# Altium project ASM001-design.PrjPcb (part 2 of 2)

## Sheet ASM001-design-3.SchDoc
size 558 x 431 mm
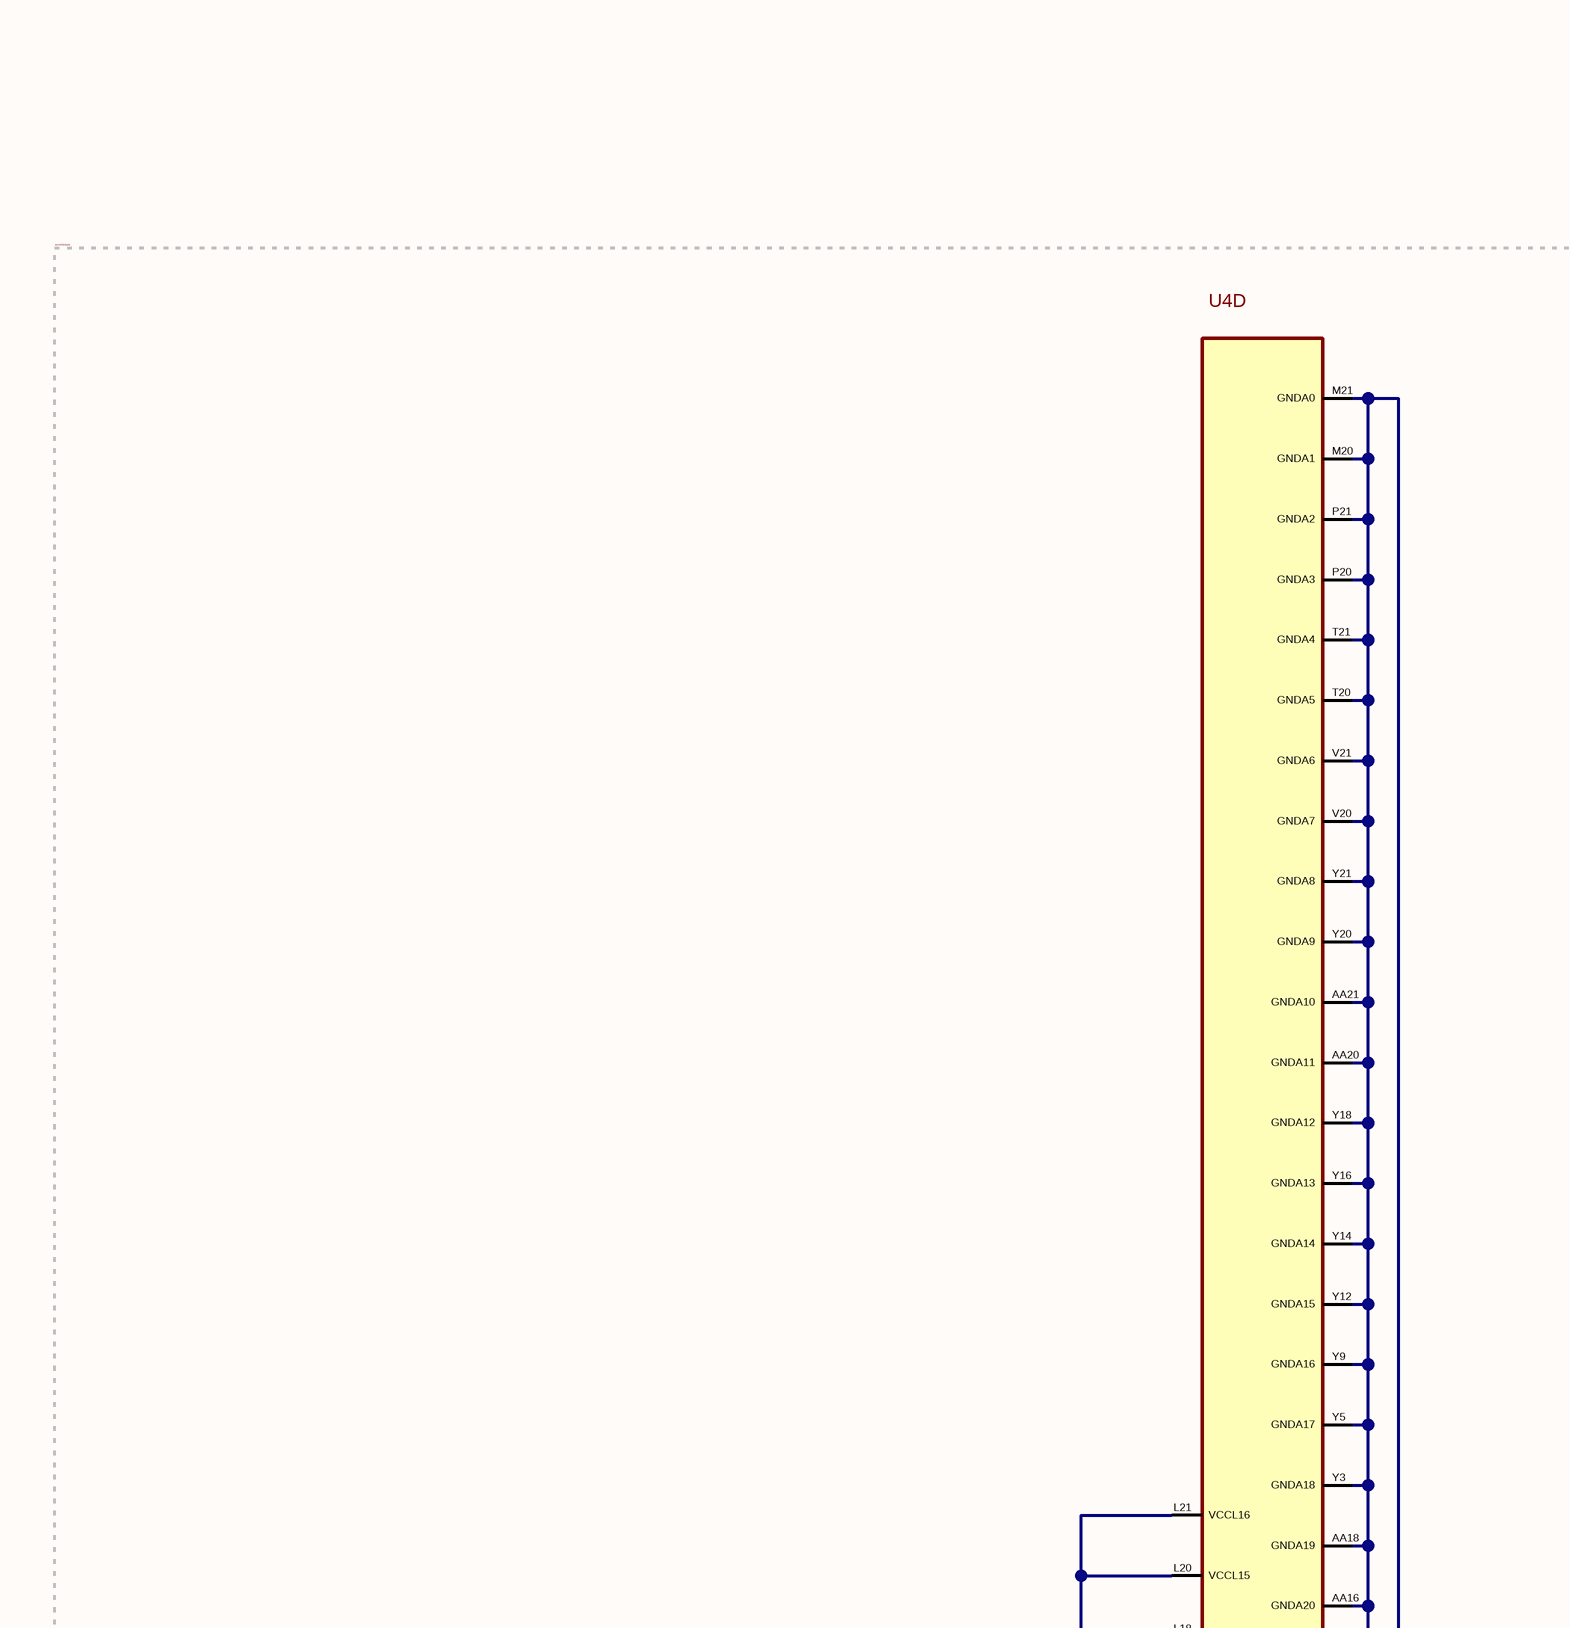
[diagram p17: ASM001-design-3.SchDoc, top column 2 of 4]
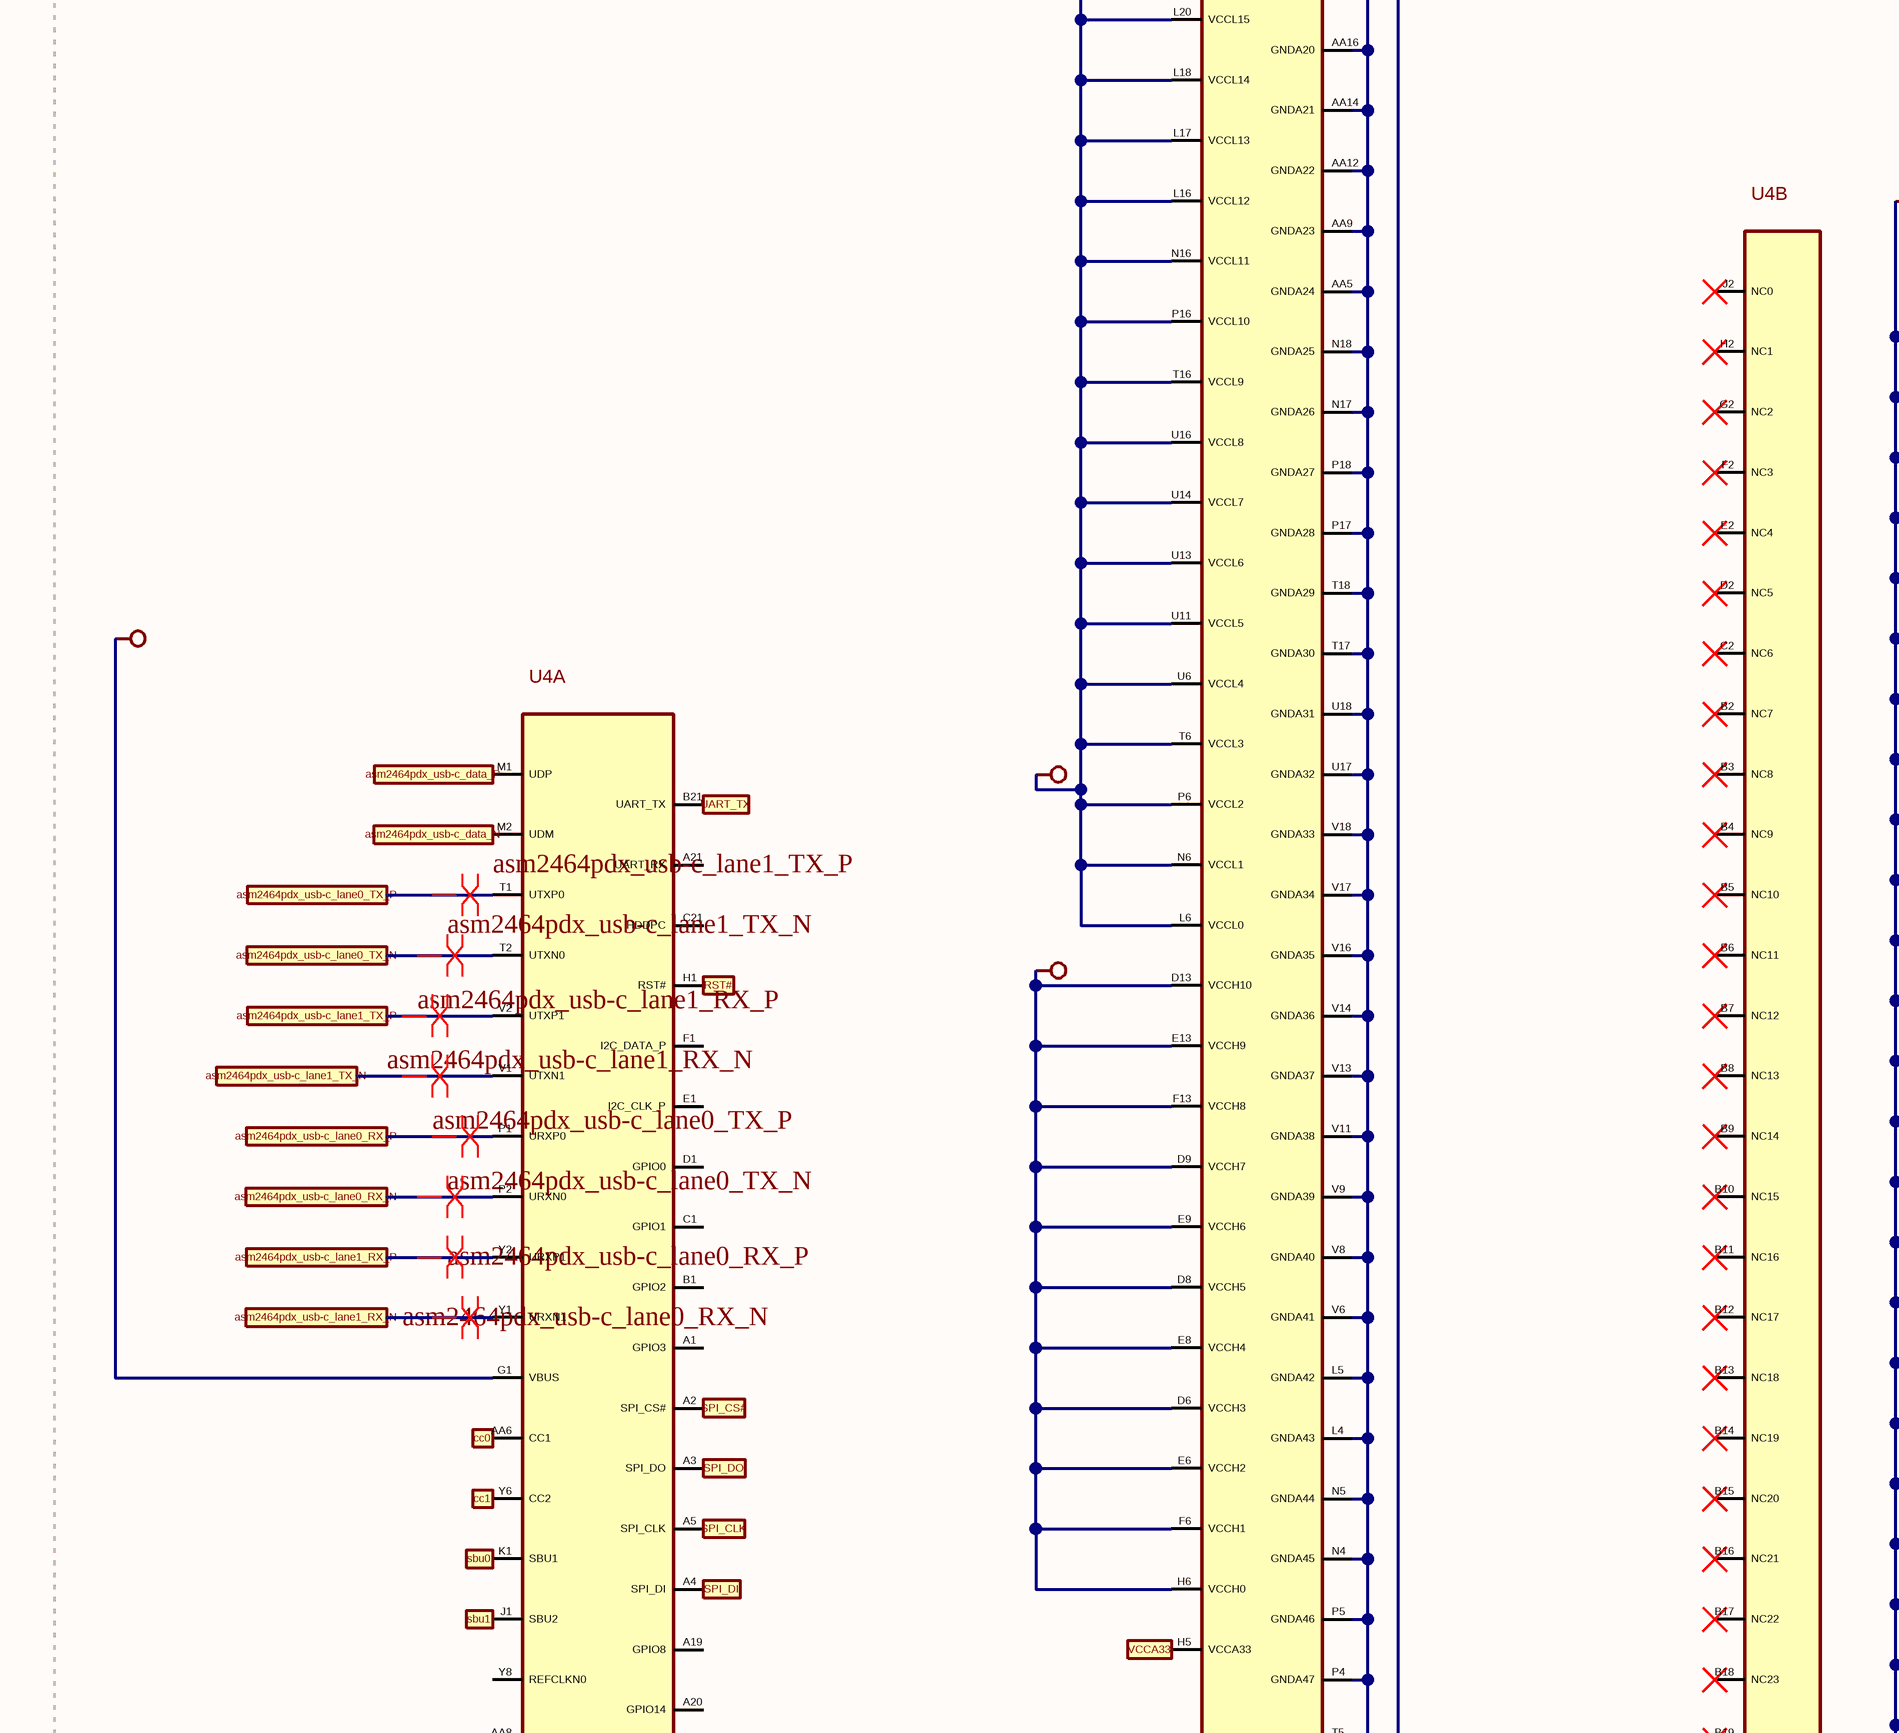
[diagram p18: ASM001-design-3.SchDoc, centre column 2 of 4]
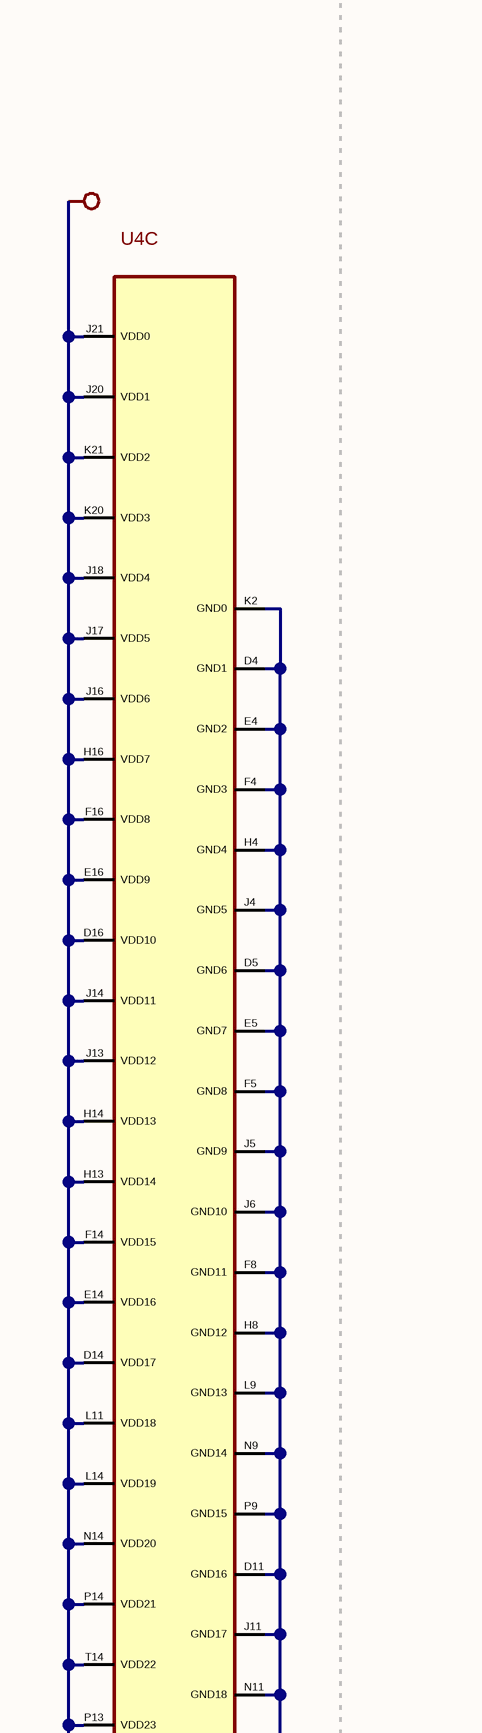
[diagram p19: ASM001-design-3.SchDoc, centre column 3 of 4]
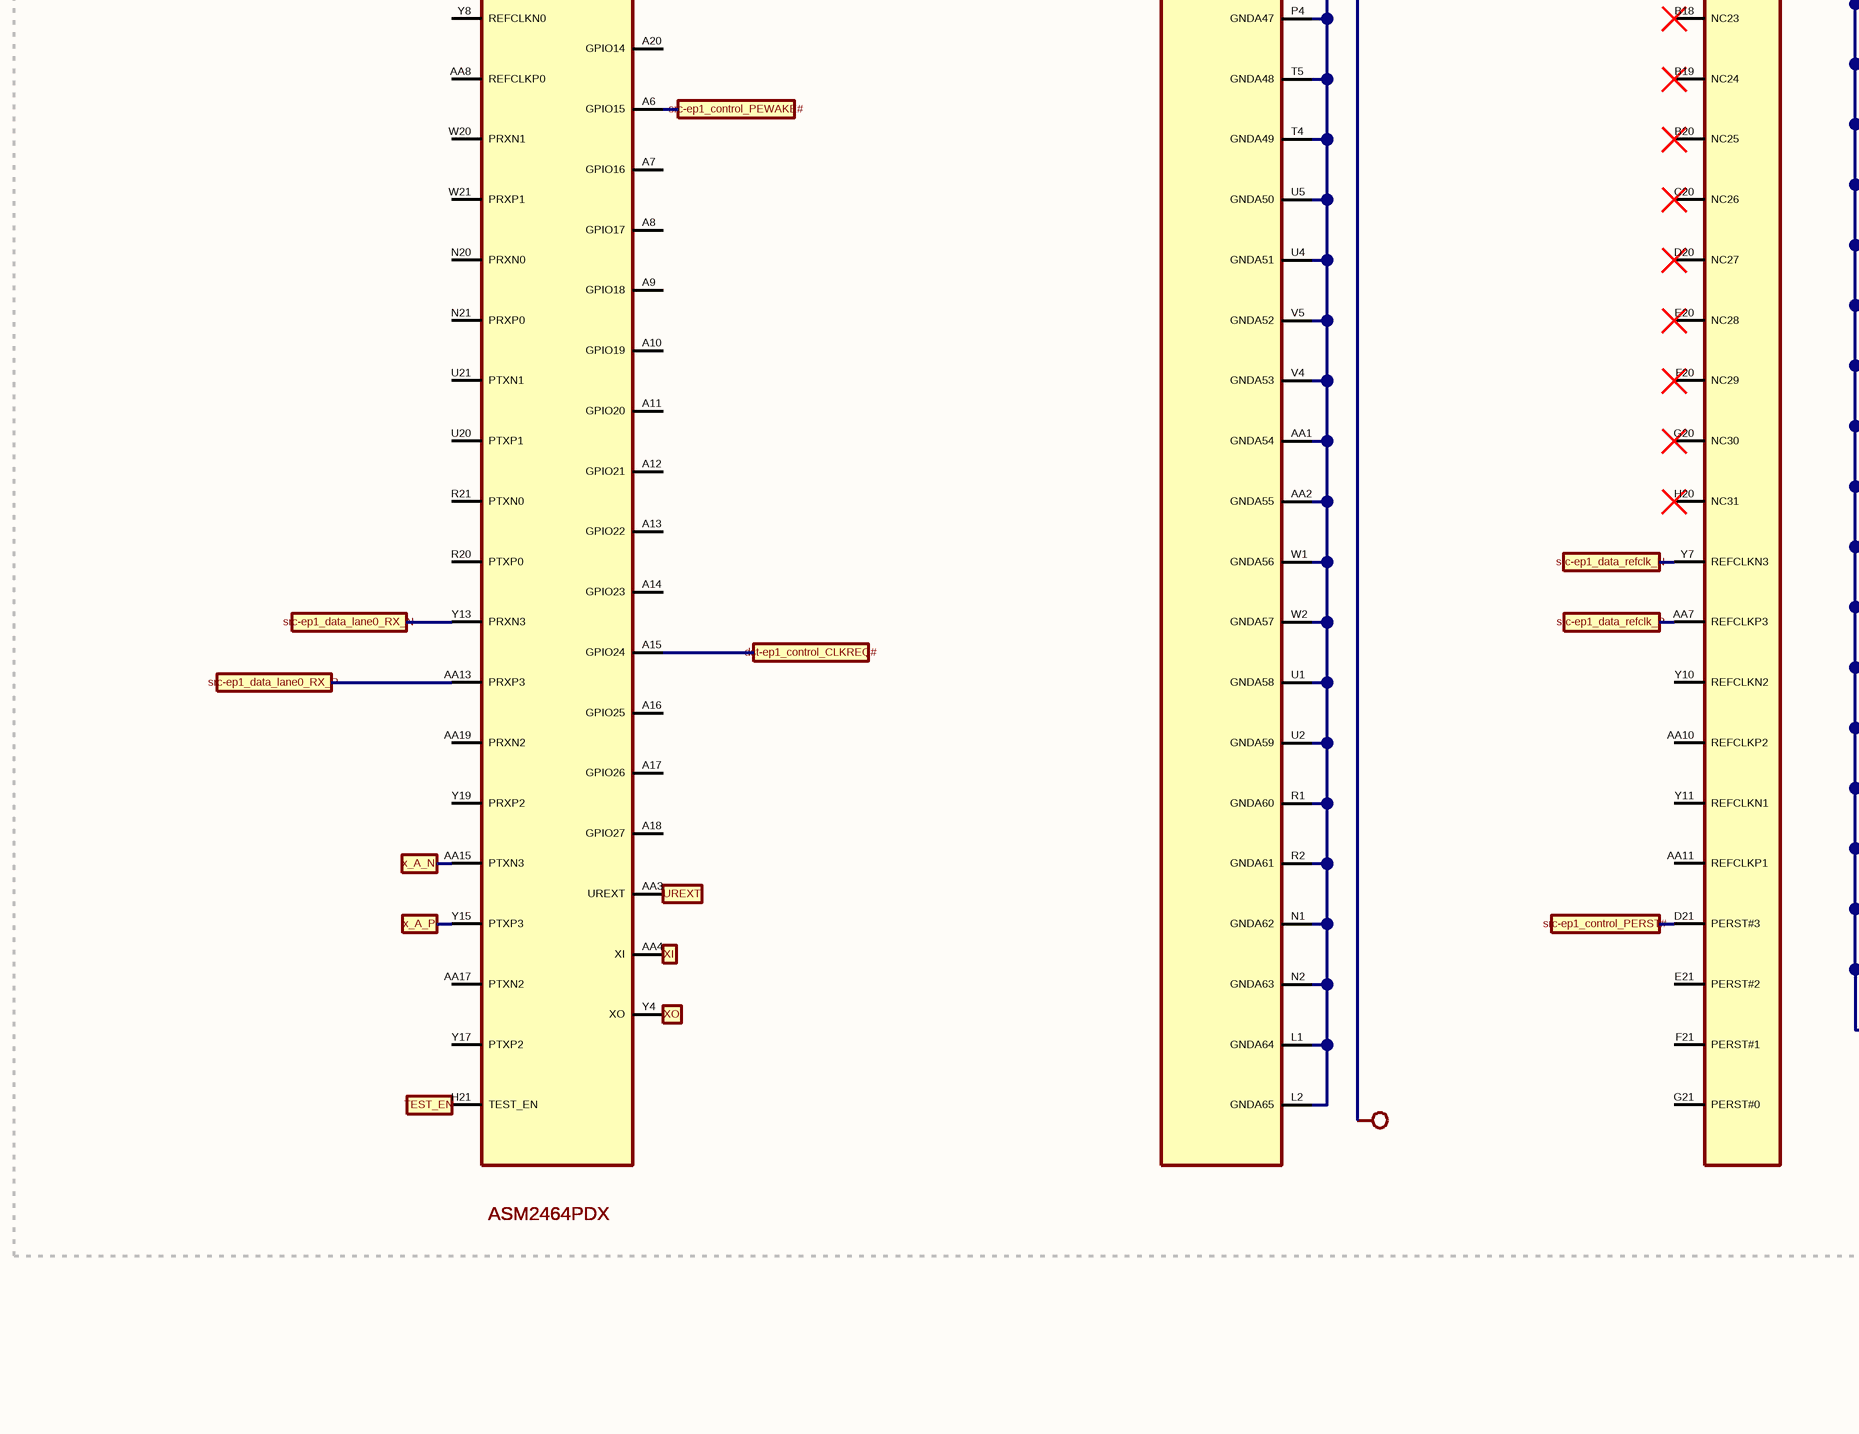
[diagram p20: ASM001-design-3.SchDoc, bottom column 2 of 4]
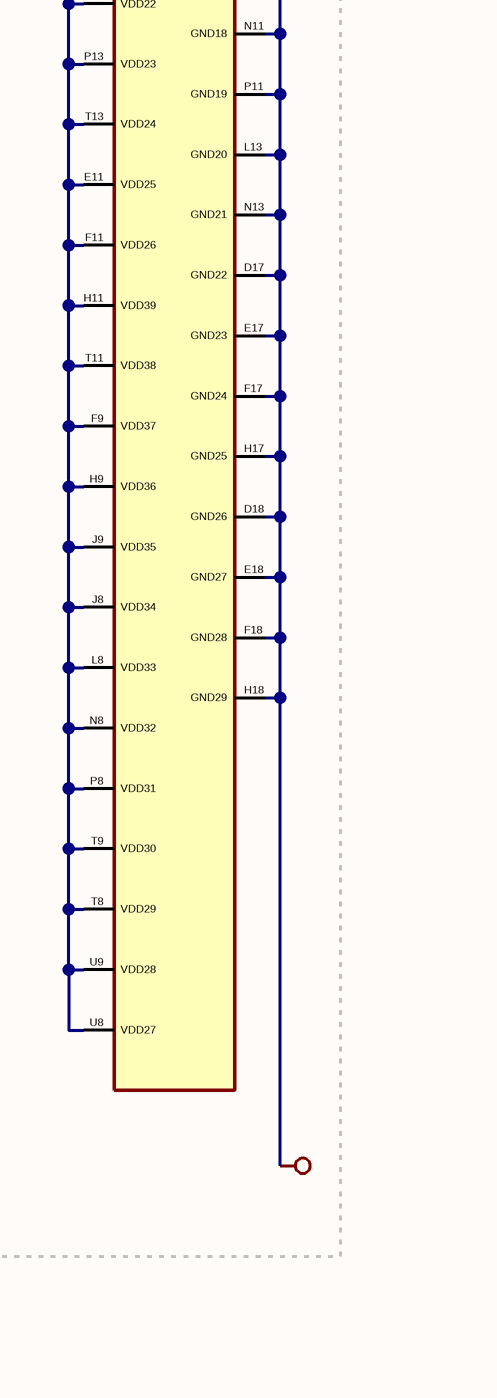
[diagram p21: ASM001-design-3.SchDoc, bottom column 3 of 4]
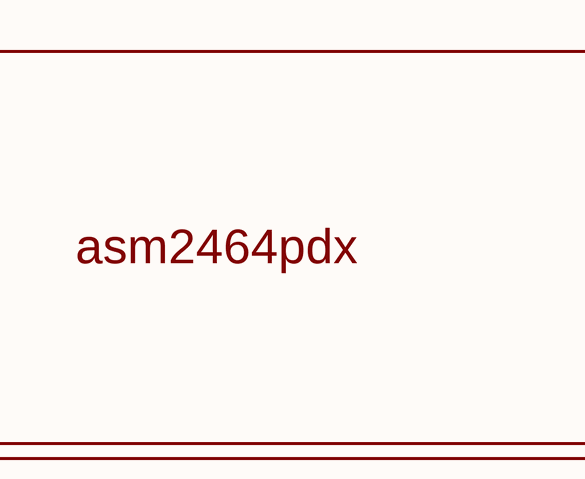
[diagram p22: ASM001-design-3.SchDoc, bottom column 4 of 4]

### Parts
U4  value ASM2464PDX  value ASM2464PDX  value ASM2464PDX  value ASM2464PDX  [BGA273N46P21X21_1000X1000X98]  (hidden comment: component$2)  (parts A,B,C,D of 4)

### Blocks framed on the sheet
asm2464pdx: U4

### Ports
asm2464pdx_usb-c_data_N, asm2464pdx_usb-c_data_P, asm2464pdx_usb-c_lane0_RX_N, asm2464pdx_usb-c_lane0_RX_P, asm2464pdx_usb-c_lane0_TX_N, asm2464pdx_usb-c_lane0_TX_P, asm2464pdx_usb-c_lane1_RX_N, asm2464pdx_usb-c_lane1_RX_P, asm2464pdx_usb-c_lane1_TX_N, asm2464pdx_usb-c_lane1_TX_P, cc0, cc1, dst-ep1_control_CLKREQ#, RST#, sbu0, sbu1, SPI_CLK, SPI_CS#, SPI_DI, SPI_DO, src-ep1_control_PERST#, src-ep1_control_PEWAKE#, src-ep1_data_lane0_RX_N, src-ep1_data_lane0_RX_P, src-ep1_data_refclk_N, src-ep1_data_refclk_P, TEST_EN, UART_TX, UREXT, VCCA33, x_A_N, x_A_P, XI, XO

### Nets
NetC1_2: U4.AA1(GNDA54) U4.AA2(GNDA55) U4.AA5(GNDA24) U4.AA9(GNDA23) U4.AA12(GNDA22) U4.AA14(GNDA21) U4.AA16(GNDA20) U4.AA18(GNDA19) U4.AA20(GNDA11) U4.AA21(GNDA10) U4.D4(GND1) U4.D5(GND6) U4.D6(VCCH3) U4.D8(VCCH5) U4.D9(VCCH7) U4.D11(GND16) U4.D13(VCCH10) U4.D14(VDD17) U4.D16(VDD10) U4.D17(GND22) U4.D18(GND26) U4.E4(GND2) U4.E5(GND7) U4.E6(VCCH2) U4.E8(VCCH4) U4.E9(VCCH6) U4.E11(VDD25) U4.E13(VCCH9) U4.E14(VDD16) U4.E16(VDD9) U4.E17(GND23) U4.E18(GND27) U4.F4(GND3) U4.F5(GND8) U4.F6(VCCH1) U4.F8(GND11) U4.F9(VDD37) U4.F11(VDD26) U4.F13(VCCH8) U4.F14(VDD15) U4.F16(VDD8) U4.F17(GND24) U4.F18(GND28) U4.G1(VBUS) U4.H4(GND4) U4.H6(VCCH0) U4.H8(GND12) U4.H9(VDD36) U4.H11(VDD39) U4.H13(VDD14) U4.H14(VDD13) U4.H16(VDD7) U4.H17(GND25) U4.H18(GND29) U4.J4(GND5) U4.J5(GND9) U4.J6(GND10) U4.J8(VDD34) U4.J9(VDD35) U4.J11(GND17) U4.J13(VDD12) U4.J14(VDD11) U4.J16(VDD6) U4.J17(VDD5) U4.J18(VDD4) U4.J20(VDD1) U4.J21(VDD0) U4.K2(GND0) U4.K20(VDD3) U4.K21(VDD2) U4.L1(GNDA64) U4.L2(GNDA65) U4.L4(GNDA43) U4.L5(GNDA42) U4.L6(VCCL0) U4.L8(VDD33) U4.L9(GND13) U4.L11(VDD18) U4.L13(GND20) U4.L14(VDD19) U4.L16(VCCL12) U4.L17(VCCL13) U4.L18(VCCL14) U4.L20(VCCL15) U4.L21(VCCL16) U4.M20(GNDA1) U4.M21(GNDA0) U4.N1(GNDA62) U4.N2(GNDA63) U4.N4(GNDA45) U4.N5(GNDA44) U4.N6(VCCL1) U4.N8(VDD32) U4.N9(GND14) U4.N11(GND18) U4.N13(GND21) U4.N14(VDD20) U4.N16(VCCL11) U4.N17(GNDA26) U4.N18(GNDA25) U4.P4(GNDA47) U4.P5(GNDA46) U4.P6(VCCL2) U4.P8(VDD31) U4.P9(GND15) U4.P11(GND19) U4.P13(VDD23) U4.P14(VDD21) U4.P16(VCCL10) U4.P17(GNDA28) U4.P18(GNDA27) U4.P20(GNDA3) U4.P21(GNDA2) U4.R1(GNDA60) U4.R2(GNDA61) U4.T4(GNDA49) U4.T5(GNDA48) U4.T6(VCCL3) U4.T8(VDD29) U4.T9(VDD30) U4.T11(VDD38) U4.T13(VDD24) U4.T14(VDD22) U4.T16(VCCL9) U4.T17(GNDA30) U4.T18(GNDA29) U4.T20(GNDA5) U4.T21(GNDA4) U4.U1(GNDA58) U4.U2(GNDA59) U4.U4(GNDA51) U4.U5(GNDA50) U4.U6(VCCL4) U4.U8(VDD27) U4.U9(VDD28) U4.U11(VCCL5) U4.U13(VCCL6) U4.U14(VCCL7) U4.U16(VCCL8) U4.U17(GNDA32) U4.U18(GNDA31) U4.V4(GNDA53) U4.V5(GNDA52) U4.V6(GNDA41) U4.V8(GNDA40) U4.V9(GNDA39) U4.V11(GNDA38) U4.V13(GNDA37) U4.V14(GNDA36) U4.V16(GNDA35) U4.V17(GNDA34) U4.V18(GNDA33) U4.V20(GNDA7) U4.V21(GNDA6) U4.W1(GNDA56) U4.W2(GNDA57) U4.Y3(GNDA18) U4.Y5(GNDA17) U4.Y9(GNDA16) U4.Y12(GNDA15) U4.Y14(GNDA14) U4.Y16(GNDA13) U4.Y18(GNDA12) U4.Y20(GNDA9) U4.Y21(GNDA8)
asm2464pdx_usb-c_data_N: U4.M2(UDM) ; port asm2464pdx_usb-c_data_N
asm2464pdx_usb-c_data_P: U4.M1(UDP) ; port asm2464pdx_usb-c_data_P
asm2464pdx_usb-c_lane0_TX_N: U4.T2(UTXN0) ; port asm2464pdx_usb-c_lane0_TX_N
asm2464pdx_usb-c_lane0_TX_N: U4.P2(URXN0) ; port asm2464pdx_usb-c_lane0_RX_N  [project net asm2464pdx_usb-c_lane0_RX_N]  [a separate net that carries the same name]
asm2464pdx_usb-c_lane0_TX_P: U4.T1(UTXP0) ; port asm2464pdx_usb-c_lane0_TX_P
asm2464pdx_usb-c_lane0_TX_P: U4.P1(URXP0) ; port asm2464pdx_usb-c_lane0_RX_P  [project net asm2464pdx_usb-c_lane0_RX_P]  [a separate net that carries the same name]
asm2464pdx_usb-c_lane1_RX_N: U4.V1(UTXN1) ; port asm2464pdx_usb-c_lane1_TX_N
asm2464pdx_usb-c_lane1_RX_N: U4.Y1(URXN1) ; port asm2464pdx_usb-c_lane1_RX_N  [a separate net that carries the same name]
asm2464pdx_usb-c_lane1_RX_P: U4.V2(UTXP1) ; port asm2464pdx_usb-c_lane1_TX_P
asm2464pdx_usb-c_lane1_RX_P: U4.Y2(URXP1) ; port asm2464pdx_usb-c_lane1_RX_P  [a separate net that carries the same name]
src-ep1_data_lane0_RX_P: U4.Y13(PRXN3) ; port src-ep1_data_lane0_RX_N
NetC2_1: U4.AA6(CC1) ; port cc0
NetC6_1: U4.Y6(CC2) ; port cc1
NetC22_1: U4.H1(RST#) ; port RST#
NetC23_1: U4.AA4(XI) ; port XI
NetC23_2: U4.Y4(XO) ; port XO
NetC35_1: U4.Y15(PTXP3) ; port x_A_P
NetC36_1: U4.AA15(PTXN3) ; port x_A_N
NetJ1_A8: U4.K1(SBU1) ; port sbu0
NetJ1_B8: U4.J1(SBU2) ; port sbu1
NetJ2_50: U4.D21(PERST#3) ; port src-ep1_control_PERST#
NetJ2_52: U4.A15(GPIO24) ; port dst-ep1_control_CLKREQ#
NetJ2_53: U4.Y7(REFCLKN3) ; port src-ep1_data_refclk_N
NetJ2_54: U4.A6(GPIO15) ; port src-ep1_control_PEWAKE#
NetJ2_55: U4.AA7(REFCLKP3) ; port src-ep1_data_refclk_P
NetR10_2: U4.H5(VCCA33) ; port VCCA33
NetR11_1: U4.B21(UART_TX) ; port UART_TX
NetR13_1: U4.AA3(UREXT) ; port UREXT
NetR14_1: U4.H21(TEST_EN) ; port TEST_EN
NetU4_A2: U4.A2(SPI_CS#) ; port SPI_CS#
NetU4_A3: U4.A3(SPI_DO) ; port SPI_DO
NetU4_A4: U4.A4(SPI_DI) ; port SPI_DI
NetU4_A5: U4.A5(SPI_CLK) ; port SPI_CLK
NetU4_AA13: U4.AA13(PRXP3) ; port src-ep1_data_lane0_RX_P

Not connected (* = marked no-connect by the designer): U4 A1(GPIO3) A7(GPIO16) A8(GPIO17) A9(GPIO18) A10(GPIO19) A11(GPIO20) A12(GPIO21) A13(GPIO22) A14(GPIO23) A16(GPIO25) A17(GPIO26) A18(GPIO27) A19(GPIO8) A20(GPIO14) A21(UART_RX) AA8(REFCLKP0) AA10(REFCLKP2) AA11(REFCLKP1) AA17(PTXN2) AA19(PRXN2) B1(GPIO2) B2(NC7)* B3(NC8)* B4(NC9)* B5(NC10)* B6(NC11)* B7(NC12)* B8(NC13)* B9(NC14)* B10(NC15)* B11(NC16)* B12(NC17)* B13(NC18)* B14(NC19)* B15(NC20)* B16(NC21)* B17(NC22)* B18(NC23)* B19(NC24)* B20(NC25)* C1(GPIO1) C2(NC6)* C20(NC26)* C21(HDDPC) D1(GPIO0) D2(NC5)* D20(NC27)* E1(I2C_CLK_P) E2(NC4)* E20(NC28)* E21(PERST#2) F1(I2C_DATA_P) F2(NC3)* F20(NC29)* F21(PERST#1) G2(NC2)* G20(NC30)* G21(PERST#0) H2(NC1)* H20(NC31)* J2(NC0)* N20(PRXN0) N21(PRXP0) R20(PTXP0) R21(PTXN0) U20(PTXP1) U21(PTXN1) W20(PRXN1) W21(PRXP1) Y8(REFCLKN0) Y10(REFCLKN2) Y11(REFCLKN1) Y17(PTXP2) Y19(PRXP2)

### Layout directives
differential pair: asm2464pdx_usb-c_lane0_RX_N, asm2464pdx_usb-c_lane0_RX_P, asm2464pdx_usb-c_lane0_TX_N, asm2464pdx_usb-c_lane0_TX_P, asm2464pdx_usb-c_lane1_RX_N, asm2464pdx_usb-c_lane1_RX_P

### Notes on the sheet
- asm2464pdx
- Labels drawn without touching a wire or pin: asm2464pdx_usb-c_lane0_RX_N, asm2464pdx_usb-c_lane0_RX_P, asm2464pdx_usb-c_lane1_TX_N, asm2464pdx_usb-c_lane1_TX_P

### Library data of the parts
U4 = component$2: REFERENCE: false; FOOTPRINT: ASM001-design:BGA273N46P21X21_1000X1000X98; MPN: ASM2464PDX

## Sheet ASM001-design-4.SchDoc
size 558 x 431 mm
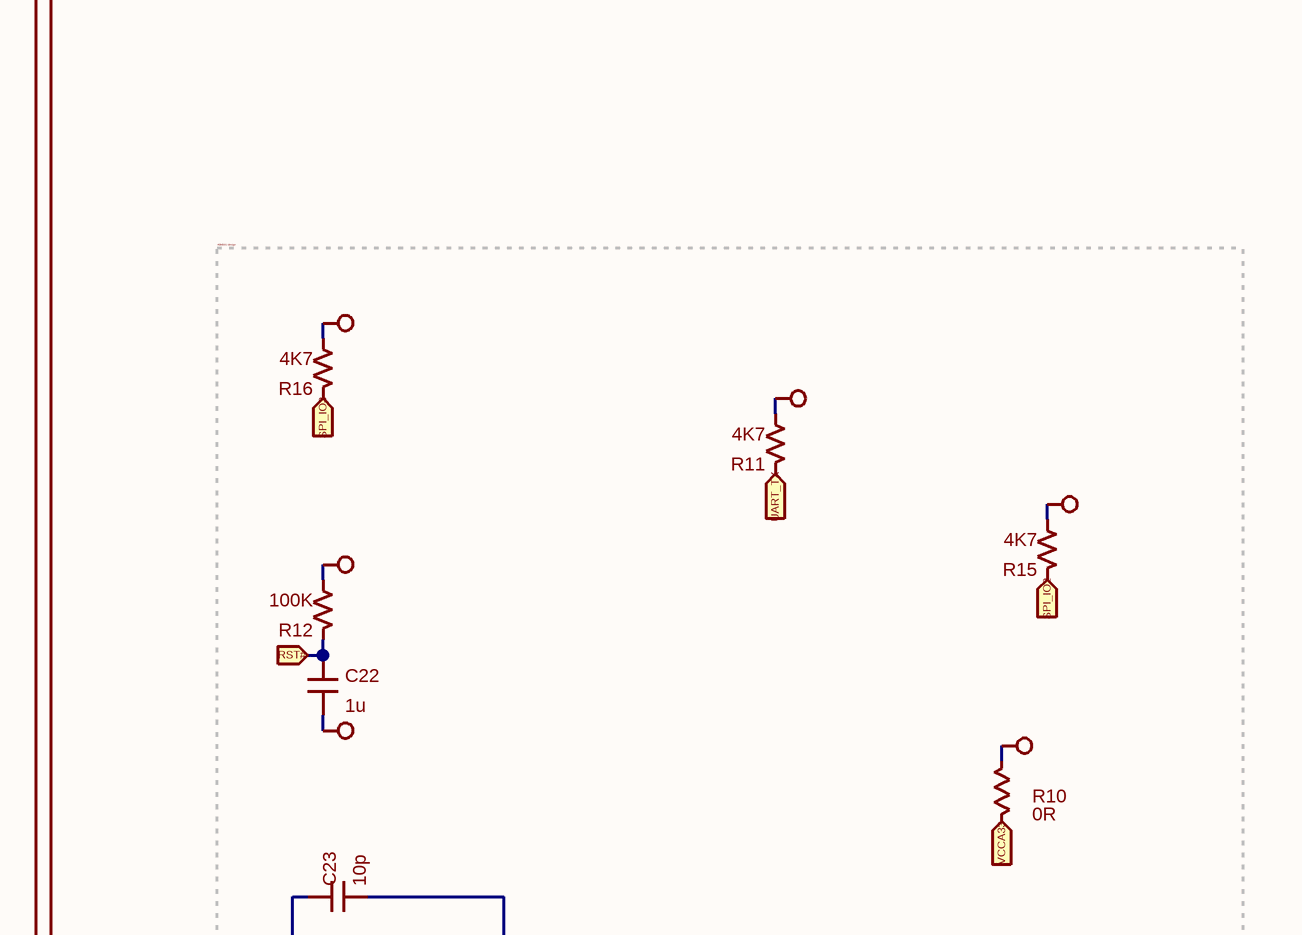
[diagram p23: ASM001-design-4.SchDoc, centre column 1 of 4]
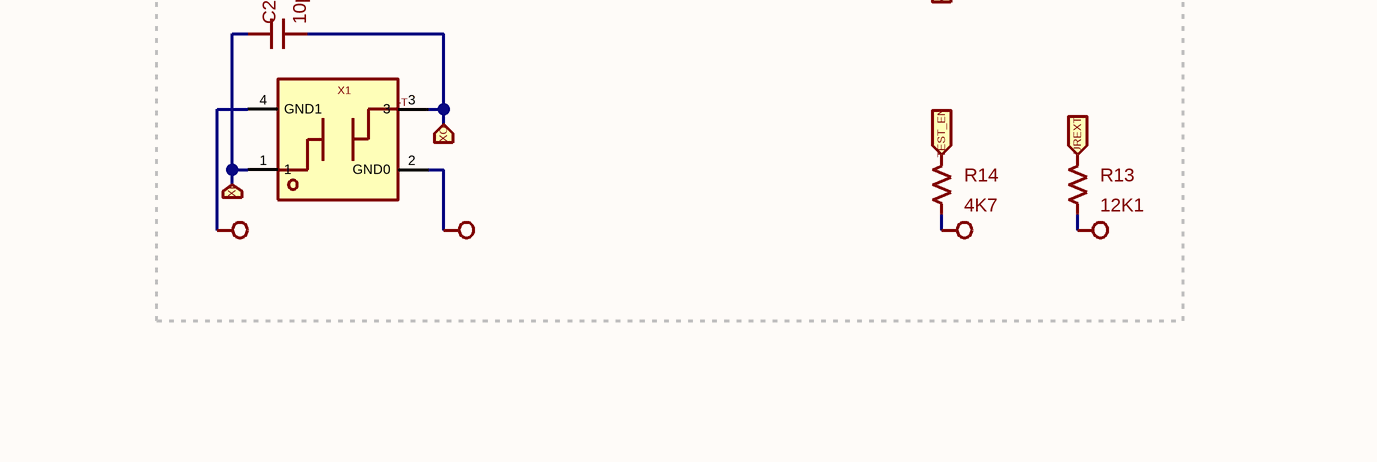
[diagram p24: ASM001-design-4.SchDoc, bottom column 1 of 4]
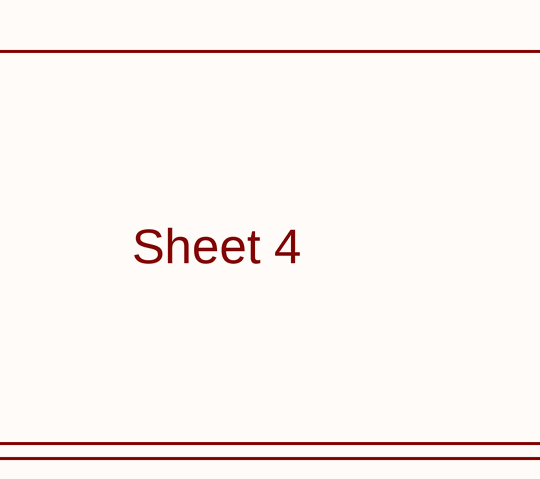
[diagram p25: ASM001-design-4.SchDoc, bottom column 4 of 4]

### Parts
C22  value 1u  [Pkg0402$2]  (hidden comment: C1518208)
C23  value 10p  [LP]  (hidden comment: my_capacitor)
R10  value 0R  [SMT_0201]  (hidden comment: C106228)
R11  value 4K7  [Pkg0402$10]  (hidden comment: my_resistor$7)
R12  value 100K  [Pkg0201$2]  (hidden comment: my_resistor$8)
R13  value 12K1  [Pkg0402$5]  (hidden comment: C168199)
R14  value 4K7  [Pkg0402$10]  (hidden comment: my_resistor$7)
R15  value 4K7  [Pkg0402$10]  (hidden comment: my_resistor$7)
R16  value 4K7  [Pkg0402$10]  (hidden comment: my_resistor$7)
X1  value ABMM2-25.000MHZ-D1-T  [LP$2]  (hidden comment: C1985419)

### Blocks framed on the sheet
ASM001-design: C22 C23 R10-R16 X1

### Ports
RST#, SPI_IO2, SPI_IO3, TEST_EN, UART_TX, UREXT, VCCA33, XI, XO

### Nets
NetC1_2: C22.2 R10.1 R11.2 R12.2 R13.2 R14.2 R15.2 R16.2 X1.2(GND0) X1.4(GND1)
NetC22_1: C22.1 R12.1 ; port RST#
NetC23_1: C23.1 X1.1 ; port XI
NetC23_2: C23.2 X1.3 ; port XO
NetR10_2: R10.2 ; port VCCA33
NetR11_1: R11.1 ; port UART_TX
NetR13_1: R13.1 ; port UREXT
NetR14_1: R14.1 ; port TEST_EN
NetR15_1: R15.1 ; port SPI_IO2
NetR16_1: R16.1 ; port SPI_IO3

### Notes on the sheet
- Sheet 4

### Library data of the parts
C22 = C1518208: manufacturer_aliases: ["Murata Electronics"]; manufacturer: Murata Electronics; mpn_aliases: ["GRM155R61H105KE05D"]; mpn: GRM155R61H105KE05D; REFERENCE: false; capacitor: true; metadata.applications: General Purpose; metadata.packaging: Tape & Reel (TR); reference_prefix: C; area: 0.5; tolerance: Toleranced(9.0e-007 <= 1.0e-006 <= 1.1e-006); rated-voltage: 50.0; query-properties: ["case" => ["0201" "0402"] "rated-voltage" => 50.0 "capacitance" => 1.0e-006 "tolerance" => 0.1 "type" => "ceramic" "temperature-coefficient.code" => ["X7R" "X5R"] "category" => "capacitor" "mounting" => "smd" "min-stock" => 1 "_sellers" => ["JLCPCB"]]; trust: low; minimum_quantity: 5; cofactr_id: CCK5EGLHOV3I; rated-temperature: Toleranced(-55.0 <= 15.0 <= 85.0); capacitance: 1.0e-006; temperature-coefficent: X5R; y: 1.0; type: ceramic; metadata.description: 50V 1uF X5R ±10% 0402  Multilayer Ceramic Capacitors MLCC - SMD/SMT ROHS; Maximum Voltage: 50.0V; FOOTPRINT: ASM001-design:Pkg0402$2; vendor_part_numbers.lcsc: C1518208; price: 0.025652174; stock: 222336; mounting: smd; case: 0402; vendor_part_numbers.digi-key: 490-GRM155R61H105KE05DTR-ND; x: 0.5; category: capacitor; Datasheet: https://wmsc.lcsc.com/wmsc/upload/file/pdf/v2/lcsc/2201180430_Murata-Electronics-GRM155R61H105KE05D_C1518208.pdf
C23 = my_capacitor: mpn_aliases: ["04025A100FAT2A"]; manufacturer_aliases: ["AVX Corporation"]; MPN: 04025A100FAT2A; Manufacturer: KYOCERA AVX; REFERENCE: false; cofactr_id: CCOVHWU6D1V4; metadata.applications: General Purpose; metadata.packaging: Tape & Reel (TR); reference_prefix: C; rated-temperature: Toleranced(-55.0 <= 35.0 <= 125.0); area: 0.5; tolerance: Toleranced(9.9e-012 <= 1.0e-011 <= 1.01e-011); capacitance: 1.0e-011; temperature-coefficent: C0G; rated-voltage: 50.0; trust: low; y: 1.0; z: 0.56; type: ceramic; metadata.description: CAP CER 10PF 50V NP0 0402; Maximum Voltage: 50.0V; FOOTPRINT: ASM001-design:LP; mounting: smd; case: 0402; x: 0.5; category: capacitor; Datasheet: https://datasheets.avx.com/C0GNP0-Dielectric.pdf
R10 = C106228: MPN: RC0201JR-070RL; Manufacturer: YAGEO; REFERENCE: false; Maximum Power: 0.05W; FOOTPRINT: ASM001-design:SMT_0201; Resistance: 0R; Datasheet: https://www.lcsc.com/datasheet/lcsc_datasheet_2304140030_YAGEO-RC0201JR-070RL_C106228.pdf
R11 R14-R16 = my_resistor$7: mpn_aliases: ["SCR0402F4K7"]; mpn: SCR0402F4K7; manufacturer_aliases: ["VO"]; manufacturer: VO; REFERENCE: false; cofactr_id: RC99FREJ1KLN; reference_prefix: R; resistor: true; area: 0.5; tolerance: Toleranced(4653.0 <= 4700.0 <= 4747.0); query-properties: ["case" => ["0201" "0402"] "resistance" => 4700.0 "tolerance" => 0.01 "category" => "resistor" "mounting" => "smd" "min-stock" => 1 "_sellers" => ["JLCPCB"]]; trust: low; y: 1.0; resistance: 4700.0; minimum_quantity: 20; metadata.description: ±1% 4.7kΩ 0402  Chip Resistor - Surface Mount ROHS; FOOTPRINT: ASM001-design:Pkg0402$10; vendor_part_numbers.lcsc: C3015810; mounting: smd; price: 0.000405797; case: 0402; stock: 1006; x: 0.5; category: resistor; Datasheet: https://wmsc.lcsc.com/wmsc/upload/file/pdf/v2/lcsc/2206021130_VO-SCR0402F4K7_C3015810.pdf
R12 = my_resistor$8: mpn_aliases: ["SC0201F1003G1BNRH"]; mpn: SC0201F1003G1BNRH; manufacturer_aliases: ["Sunway"]; manufacturer: Sunway; REFERENCE: false; reference_prefix: R; resistor: true; area: 0.18; tolerance: Toleranced(99000.0 <= 100000.0 <= 101000.0); query-properties: ["case" => ["0201" "0402"] "resistance" => 100000.0 "tolerance" => 0.01 "category" => "resistor" "mounting" => "smd" "min-stock" => 1 "_sellers" => ["JLCPCB"]]; x: 0.3; trust: low; y: 0.6; resistance: 100000.0; minimum_quantity: 20; rated-power: 0.05; metadata.description: 50mW ±1% ±200ppm/℃ 100kΩ 0201  Chip Resistor - Surface Mount ROHS; Maximum Power: 0.05W; FOOTPRINT: ASM001-design:Pkg0201$2; vendor_part_numbers.lcsc: C3152012; mounting: smd; price: 0.000463768; case: 0201; stock: 11487; category: resistor; Datasheet: https://datasheet.lcsc.com/lcsc/2207281830_Sunway-SC0201F1003G1BNRH_C3152012.pdf
R13 = C168199: manufacturer_aliases: ["Walsin Technology Corporation"]; manufacturer: Walsin Technology Corporation; mpn_aliases: ["WR04X1212FTL"]; mpn: WR04X1212FTL; REFERENCE: false; metadata.number-of-terminations: 2.0; TCR: [-0.0001 0.0001]; metadata.packaging: Tape & Reel (TR); reference_prefix: R; resistor: true; area: 0.5; tolerance: Toleranced(11979.0 <= 12100.0 <= 12221.0); query-properties: ["tolerance" => 0.01 "case" => ["0201" "0402"] "resistance" => 12100.0 "category" => "resistor" "mounting" => "smd" "min-stock" => 1 "_sellers" => ["JLCPCB"]]; trust: low; minimum_quantity: 20; cofactr_id: XX5RG112LRR9; rated-temperature: Toleranced(-55.0 <= 50.0 <= 155.0); y: 1.0; resistance: 12100.0; rated-power: 0.063; metadata.description: 62.5mW Thick Film Resistors ±100ppm/℃ ±1% 12.1kΩ 0402  Chip Resistor - Surface Mount ROHS; Maximum Power: 0.063W; FOOTPRINT: ASM001-design:Pkg0402$5; vendor_part_numbers.lcsc: C168199; price: 0.000362319; stock: 3370; mounting: smd; composition: thick-film; case: 0402; metadata.supplier-device-package: 402; vendor_part_numbers.digi-key: 1292-WR04X1212FTLTR-ND; x: 0.5; type: chip; category: resistor; Datasheet: https://www.lcsc.com/datasheet/lcsc_datasheet_2304140030_Walsin-Tech-Corp-WR04X1212FTL_C168199.pdf
X1 = C1985419: manufacturer_aliases: ["Abracon LLC"]; mpn_aliases: ["ABMM2-25.000MHZ-D1-T"]; Manufacturer: ABRACON; REFERENCE: false; cofactr_id: OSDU487NIJMB; reference_prefix: X; x: 6.302; trust: low; y: 3.901; area: 24.584; FOOTPRINT: ASM001-design:LP$2; case: SMD6036-4P; mounting: smd; category: resonator; MPN: ABMM2-25.000MHZ-D1-T; Datasheet: https://wmsc.lcsc.com/wmsc/upload/file/pdf/v2/lcsc/2304140030_Abracon-LLC-ABMM2-25-000MHZ-D1-T_C1985419.pdf

## Sheet ASM001-design-5.SchDoc
size 558 x 431 mm
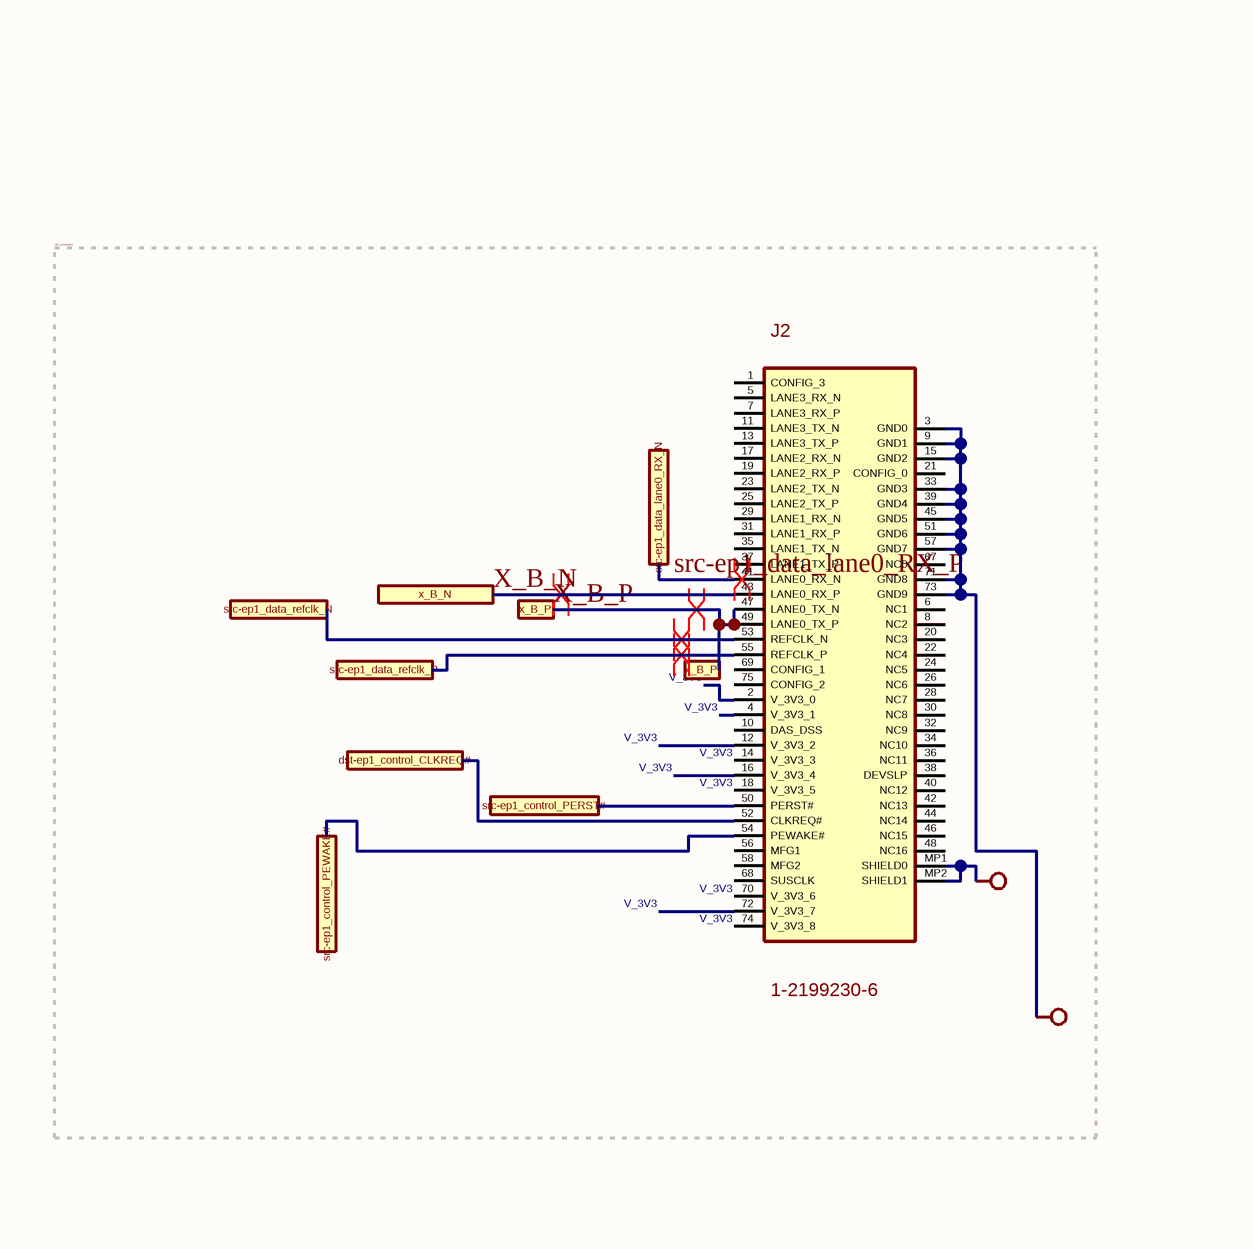
[diagram p26: ASM001-design-5.SchDoc, bottom column 2 of 4]
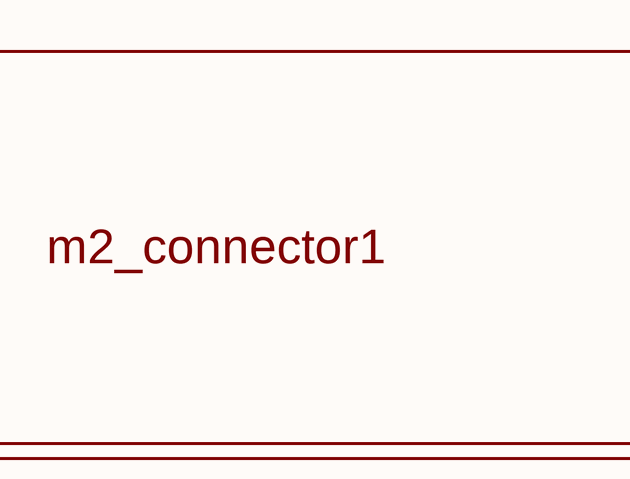
[diagram p27: ASM001-design-5.SchDoc, bottom column 4 of 4]

### Parts
J2  value 1-2199230-6  [LP_1_2199230_6]  (hidden comment: component)

### Blocks framed on the sheet
m2_connector1: J2

### Ports
dst-ep1_control_CLKREQ#, src-ep1_control_PERST#, src-ep1_control_PEWAKE#, src-ep1_data_lane0_RX_N, src-ep1_data_refclk_N, src-ep1_data_refclk_P, x_B_N, x_B_P

### Nets
NetC1_2: J2.3(GND0) J2.9(GND1) J2.15(GND2) J2.33(GND3) J2.39(GND4) J2.45(GND5) J2.51(GND6) J2.57(GND7) J2.71(GND8) J2.73(GND9) J2.MP1(SHIELD0) J2.MP2(SHIELD1)
src-ep1_data_lane0_RX_P: J2.41(LANE0_RX_N) ; port src-ep1_data_lane0_RX_N
V_3V3: J2.2(V_3V3_0) J2.4(V_3V3_1) J2.12(V_3V3_2) J2.14(V_3V3_3) J2.16(V_3V3_4) J2.18(V_3V3_5) J2.70(V_3V3_6) J2.72(V_3V3_7) J2.74(V_3V3_8)
X_B_N: J2.43(LANE0_RX_P) ; port x_B_N
X_B_P: J2.47(LANE0_TX_N) J2.49(LANE0_TX_P) ; port x_B_P
NetJ2_50: J2.50(PERST#) ; port src-ep1_control_PERST#
NetJ2_52: J2.52(CLKREQ#) ; port dst-ep1_control_CLKREQ#
NetJ2_53: J2.53(REFCLK_N) ; port src-ep1_data_refclk_N
NetJ2_54: J2.54(PEWAKE#) ; port src-ep1_control_PEWAKE#
NetJ2_55: J2.55(REFCLK_P) ; port src-ep1_data_refclk_P

Not connected (* = marked no-connect by the designer): J2 1(CONFIG_3) 5(LANE3_RX_N) 6(NC1) 7(LANE3_RX_P) 8(NC2) 10(DAS_DSS) 11(LANE3_TX_N) 13(LANE3_TX_P) 17(LANE2_RX_N) 19(LANE2_RX_P) 20(NC3) 21(CONFIG_0) 22(NC4) 23(LANE2_TX_N) 24(NC5) 25(LANE2_TX_P) 26(NC6) 28(NC7) 29(LANE1_RX_N) 30(NC8) 31(LANE1_RX_P) 32(NC9) 34(NC10) 35(LANE1_TX_N) 36(NC11) 37(LANE1_TX_P) 38(DEVSLP) 40(NC12) 42(NC13) 44(NC14) 46(NC15) 48(NC16) 56(MFG1) 58(MFG2) 67(NC0) 68(SUSCLK) 69(CONFIG_1) 75(CONFIG_2)

### Layout directives
differential pair: NetJ2_53, NetJ2_55, src-ep1_data_lane0_RX_P, X_B_N, X_B_P

### Notes on the sheet
- m2_connector1

### Library data of the parts
J2 = component: manufacturer: TE Connectivity; REFERENCE: false; FOOTPRINT: ASM001-design:LP_1_2199230_6; Digi-Key_Part_Number: A118046TR-ND; MPN: 1-2199230-6

## Nets that join several sheets
NetC1_2: ASM001-design-1 (10 pins), ASM001-design-2 (56 pins), ASM001-design-3 (165 pins), ASM001-design-4 (10 pins), ASM001-design-5 (12 pins)
asm2464pdx_usb-c_data_N: ASM001-design-1 (J1.A7 J1.B7 U7.1 U7.2), ASM001-design-2 (U8.5 U8.6), ASM001-design-3 (U4.M2)
asm2464pdx_usb-c_data_P: ASM001-design-1 (J1.A6 J1.B6 U6.1 U6.2), ASM001-design-2 (U8.4 U8.7), ASM001-design-3 (U4.M1)
asm2464pdx_usb-c_lane0_RX_N: ASM001-design-1 (J1.B10), ASM001-design-2 (R7.1), ASM001-design-3 (U4.P2)
asm2464pdx_usb-c_lane0_RX_P: ASM001-design-1 (J1.B11), ASM001-design-2 (R17.1), ASM001-design-3 (U4.P1)
asm2464pdx_usb-c_lane0_TX_N: ASM001-design-1 (J1.A3), ASM001-design-2 (R29.1), ASM001-design-3 (U4.T2)
asm2464pdx_usb-c_lane0_TX_P: ASM001-design-1 (J1.A2), ASM001-design-2 (R27.1), ASM001-design-3 (U4.T1)
asm2464pdx_usb-c_lane1_RX_N: ASM001-design-1 (J1.B3), ASM001-design-2 (R33.1), ASM001-design-3 (U4.V1)
asm2464pdx_usb-c_lane1_RX_N: ASM001-design-1 (J1.A10), ASM001-design-2 (R31.1), ASM001-design-3 (U4.Y1)
asm2464pdx_usb-c_lane1_RX_P: ASM001-design-1 (J1.B2), ASM001-design-2 (R32.1), ASM001-design-3 (U4.V2)
asm2464pdx_usb-c_lane1_RX_P: ASM001-design-1 (J1.A11), ASM001-design-2 (R30.1), ASM001-design-3 (U4.Y2)
NetC1_1: ASM001-design-1 (J1.M4), ASM001-design-2 (C1.1 R28.1)
NetC2_1: ASM001-design-1 (J1.A5), ASM001-design-2 (C2.1), ASM001-design-3 (U4.AA6)
NetC6_1: ASM001-design-1 (J1.B5), ASM001-design-2 (C6.1), ASM001-design-3 (U4.Y6)
NetC22_1: ASM001-design-3 (U4.H1), ASM001-design-4 (C22.1 R12.1)
NetC23_1: ASM001-design-3 (U4.AA4), ASM001-design-4 (C23.1 X1.1)
NetC23_2: ASM001-design-3 (U4.Y4), ASM001-design-4 (C23.2 X1.3)
NetC35_1: ASM001-design-1 (C35.1), ASM001-design-3 (U4.Y15)
NetC36_1: ASM001-design-1 (C36.1), ASM001-design-3 (U4.AA15)
NetJ1_A8: ASM001-design-1 (J1.A8), ASM001-design-3 (U4.K1)
NetJ1_B8: ASM001-design-1 (J1.B8), ASM001-design-3 (U4.J1)
NetJ2_50: ASM001-design-3 (U4.D21), ASM001-design-5 (J2.50)
NetJ2_52: ASM001-design-3 (U4.A15), ASM001-design-5 (J2.52)
NetJ2_53: ASM001-design-3 (U4.Y7), ASM001-design-5 (J2.53)
NetJ2_54: ASM001-design-3 (U4.A6), ASM001-design-5 (J2.54)
NetJ2_55: ASM001-design-3 (U4.AA7), ASM001-design-5 (J2.55)
NetR10_2: ASM001-design-3 (U4.H5), ASM001-design-4 (R10.2)
NetR11_1: ASM001-design-3 (U4.B21), ASM001-design-4 (R11.1)
NetR13_1: ASM001-design-3 (U4.AA3), ASM001-design-4 (R13.1)
NetR14_1: ASM001-design-3 (U4.H21), ASM001-design-4 (R14.1)
NetR15_1: ASM001-design-1 (U5.3), ASM001-design-4 (R15.1)
NetR16_1: ASM001-design-1 (U5.7), ASM001-design-4 (R16.1)
NetU4_A2: ASM001-design-1 (U5.1), ASM001-design-3 (U4.A2)
NetU4_A3: ASM001-design-1 (U5.2), ASM001-design-3 (U4.A3)
NetU4_A4: ASM001-design-1 (U5.5), ASM001-design-3 (U4.A4)
NetU4_A5: ASM001-design-1 (U5.6), ASM001-design-3 (U4.A5)
src-ep1_data_lane0_RX_P: ASM001-design-3 (U4.Y13), ASM001-design-5 (J2.41)
X_B_N: ASM001-design-1 (C36.2), ASM001-design-5 (J2.43)
X_B_P: ASM001-design-1 (C35.2), ASM001-design-5 (J2.47 J2.49)